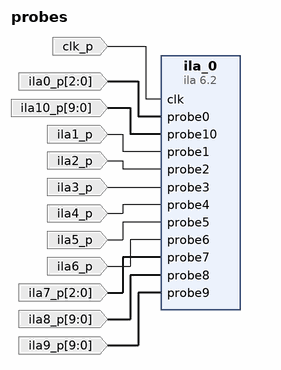
[diagram p0: block diagram of the top level]
# Vivado block design probes, xc7z020clg400-1, Vivado 2023.2
create_bd_design probes

create_bd_port -dir I -from 2 -to 0 -type data ila0_p
create_bd_port -dir I -type clk clk_p
set_property -dict {CONFIG.FREQ_HZ 125000000} [get_bd_ports clk_p]
create_bd_port -dir I ila1_p
create_bd_port -dir I ila2_p
create_bd_port -dir I -type data ila3_p
create_bd_port -dir I -type data ila4_p
create_bd_port -dir I ila5_p
create_bd_port -dir I ila6_p
create_bd_port -dir I -from 2 -to 0 -type data ila7_p
create_bd_port -dir I -from 9 -to 0 -type data ila8_p
create_bd_port -dir I -from 9 -to 0 -type data ila9_p
create_bd_port -dir I -from 9 -to 0 -type data ila10_p

create_bd_cell -type ip -vlnv xilinx.com:ip:ila:6.2 ila_0
set_property -dict [list \
  CONFIG.ALL_PROBE_SAME_MU_CNT 4 \
  CONFIG.C_DATA_DEPTH 4096 \
  CONFIG.C_MONITOR_TYPE Native \
  CONFIG.C_NUM_OF_PROBES 11 \
  CONFIG.C_PROBE0_WIDTH 3 \
  CONFIG.C_PROBE10_WIDTH 10 \
  CONFIG.C_PROBE7_WIDTH 3 \
  CONFIG.C_PROBE8_WIDTH 10 \
  CONFIG.C_PROBE9_WIDTH 10 \
] [get_bd_cells ila_0]

# ---- connections ----

connect_bd_net [get_bd_ports clk_p] [get_bd_pins ila_0/clk]
connect_bd_net -net ila0_p_1 [get_bd_ports ila0_p] [get_bd_pins ila_0/probe0]
connect_bd_net [get_bd_ports ila10_p] [get_bd_pins ila_0/probe10]
connect_bd_net -net ila1_p_1 [get_bd_ports ila1_p] [get_bd_pins ila_0/probe1]
connect_bd_net -net ila2_p_1 [get_bd_ports ila2_p] [get_bd_pins ila_0/probe2]
connect_bd_net -net ila3_p_1 [get_bd_ports ila3_p] [get_bd_pins ila_0/probe3]
connect_bd_net -net ila4_p_1 [get_bd_ports ila4_p] [get_bd_pins ila_0/probe4]
connect_bd_net -net ila5_p_1 [get_bd_ports ila5_p] [get_bd_pins ila_0/probe5]
connect_bd_net -net ila6_p_1 [get_bd_ports ila6_p] [get_bd_pins ila_0/probe6]
connect_bd_net [get_bd_ports ila7_p] [get_bd_pins ila_0/probe7]
connect_bd_net [get_bd_ports ila8_p] [get_bd_pins ila_0/probe8]
connect_bd_net [get_bd_ports ila9_p] [get_bd_pins ila_0/probe9]
set_property HDL_ATTRIBUTE.DEBUG true [get_bd_nets ila0_p_1]
set_property HDL_ATTRIBUTE.MARK_DEBUG true [get_bd_nets ila0_p_1]
set_property HDL_ATTRIBUTE.DEBUG true [get_bd_nets ila1_p_1]
set_property HDL_ATTRIBUTE.MARK_DEBUG true [get_bd_nets ila1_p_1]
set_property HDL_ATTRIBUTE.DEBUG true [get_bd_nets ila2_p_1]
set_property HDL_ATTRIBUTE.MARK_DEBUG true [get_bd_nets ila2_p_1]
set_property HDL_ATTRIBUTE.DEBUG true [get_bd_nets ila3_p_1]
set_property HDL_ATTRIBUTE.MARK_DEBUG true [get_bd_nets ila3_p_1]
set_property HDL_ATTRIBUTE.DEBUG true [get_bd_nets ila4_p_1]
set_property HDL_ATTRIBUTE.MARK_DEBUG true [get_bd_nets ila4_p_1]
set_property HDL_ATTRIBUTE.DEBUG true [get_bd_nets ila5_p_1]
set_property HDL_ATTRIBUTE.MARK_DEBUG true [get_bd_nets ila5_p_1]
set_property HDL_ATTRIBUTE.DEBUG true [get_bd_nets ila6_p_1]
set_property HDL_ATTRIBUTE.MARK_DEBUG true [get_bd_nets ila6_p_1]

validate_bd_design
save_bd_design
